# EAGLE schematic seniorDesign (EAGLE 8.7.0)
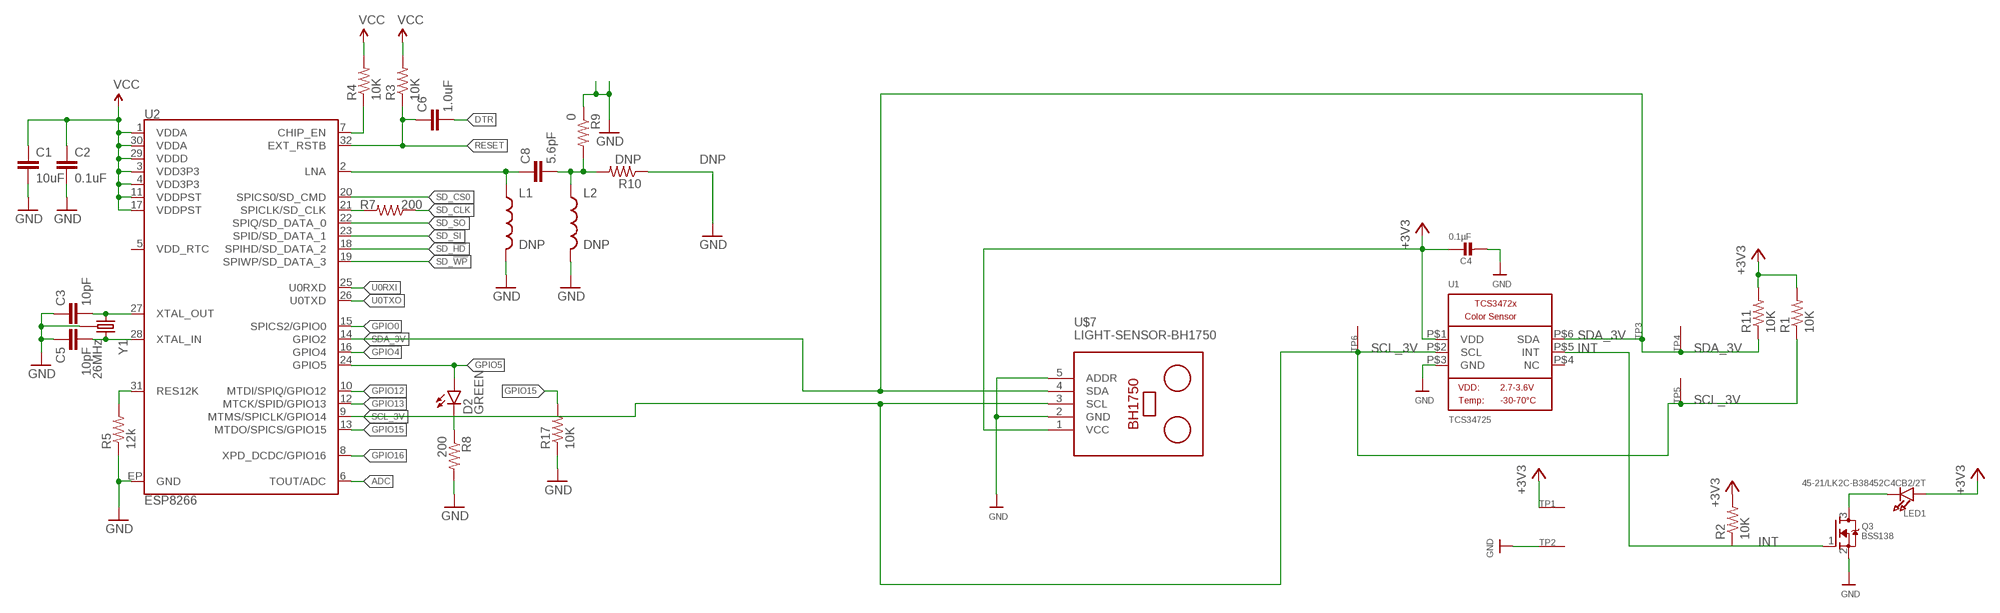
[diagram p0: schematic, sheet 1]

## Parts
C1  10uF  10UF-6.3V-20%(0603)  [0603-CAP]
C2  0.1uF  0.1UF-25V(+80/-20%)(0603)  [0603-CAP]
C3  10pF  10PF-50V-5%(0603)  [0603-CAP]
C4  0.1µF  CAP_CERAMIC_0805  [_0805]
C5  10pF  10PF-50V-5%(0603)  [0603-CAP]
C6  1.0uF  1.0UF-16V-10%(0603)  [0603-CAP]
C8  5.6pF  CAP0603-CAP  [0603-CAP]
D2  GREEN  LED-GREEN0603  [LED-0603]
L1  DNP  INDUCTOR0603  [0603]
L2  DNP  INDUCTOR0603  [0603]
LED1  45-21/LK2C-B38452C4CB2/2T  LEDEV45-21  [EVERLIGHT_45-21]
Q3  BSS138  MOSFET-NWIDE  [SOT23-WIDE]
R1  10K  10KOHM1/10W1%(0603)0603  [0603-RES]
R2  10K  10KOHM1/10W1%(0603)0603  [0603-RES]
R3  10K  10KOHM1/10W1%(0603)0603  [0603-RES]
R4  10K  10KOHM1/10W1%(0603)0603  [0603-RES]
R5  12k  12KOHM-1/10W-1%(0603)  [0603-RES]
R7  200  200OHM1/10W1%(0603)  [0603-RES]
R8  200  200OHM1/10W1%(0603)  [0603-RES]
R9  0  0OHM1/10W5%(0603)  [0603]
R10  DNP  RESISTOR0603-RES  [0603-RES]
R11  10K  10KOHM1/10W1%(0603)0603  [0603-RES]
R17  10K  10KOHM1/10W1%(0603)0603  [0603-RES]
TP1  SEWTAP0.5IN  [SEWINGTAP_0.5]
TP2  SEWTAP0.5IN  [SEWINGTAP_0.5]
TP3  SEWTAP0.5IN  [SEWINGTAP_0.5]
TP4  SEWTAP0.5IN  [SEWINGTAP_0.5]
TP5  SEWTAP0.5IN  [SEWINGTAP_0.5]
TP6  SEWTAP0.5IN  [SEWINGTAP_0.5]
U1  TCS34725  LIGHT_TCS3472  [TCS3472_FN6]
U2  ESP8266  [QFN32]
U$7  LIGHT-SENSOR-BH1750  [LIGHT-SENSOR-BH1750]
Y1  26MHz  CRYSTAL-GROUNDED3.2X2.5  [CRYSTAL-SMD-3.2X2.5]

## Nets
+3V3: C4.1 LED1.A R2.2 R11.2 TP1.TAP(SEW) U1.P$1(VDD) U$7.1(VCC)
ADC: U2.6(TOUT/ADC)
CHIP_EN: R4.1 U2.7(CHIP_EN)
DTR: C6.2
GND: C1.2 C2.2 C3.1 C4.2 C5.1 L1.2 L2.2 Q3.2(S) R5.1 R8.2 R9.1 R10.1 R17.1 TP2.TAP(SEW) U1.P$3(GND) U2.EP(GND) U$7.2(GND) U$7.5(ADDR) Y1.2(GND) Y1.4(GND)
GPIO0: U2.15(SPICS2/GPIO0)
GPIO4: U2.16(GPIO4)
GPIO5: D2.A U2.24(GPIO5)
GPIO12: U2.10(MTDI/SPIQ/GPIO12)
GPIO13: U2.12(MTCK/SPID/GPIO13)
GPIO15: R17.2 U2.13(MTDO/SPICS/GPIO15)
GPIO16: U2.8(XPD_DCDC/GPIO16)
INT: Q3.1(G) U1.P$5(INT)
LNA: C8.1 L1.1 U2.2(LNA)
N$1: LED1.K(C) Q3.3(D)
N$5: R5.2 U2.31(RES12K)
N$6: C5.2 U2.28(XTAL_IN) Y1.3
N$7: C3.2 U2.27(XTAL_OUT) Y1.1
N$8: C8.2 L2.1 R9.2 R10.2
N$9: R7.2 U2.21(SPICLK/SD_CLK)
N$15: D2.C R8.1
RESET: C6.1 R3.1 U2.32(EXT_RSTB)
SCL_3V: TP5.TAP(SEW) TP6.TAP(SEW) U1.P$2(SCL) U2.9(MTMS/SPICLK/GPIO14) U$7.3(SCL)
SD_!HD!: U2.18(SPIHD/SD_DATA_2)
SD_!WP!: U2.19(SPIWP/SD_DATA_3)
SD_CLK: R7.1
SD_CS0: U2.20(SPICS0/SD_CMD)
SD_SI: U2.23(SPID/SD_DATA_1)
SD_SO: U2.22(SPIQ/SD_DATA_0)
SDA_3V: R11.1 TP3.TAP(SEW) TP4.TAP(SEW) U1.P$6(SDA) U2.14(GPIO2) U$7.4(SDA)
U0RXI: U2.25(U0RXD)
U0TXO: U2.26(U0TXD)
VCC: C1.1 C2.1 R3.2 R4.2 U2.1(VDDA) U2.3(VDD3P3) U2.4(VDD3P3) U2.11(VDDPST) U2.17(VDDPST) U2.29(VDDD) U2.30(VDDA)
Unconnected: R1.1 R1.2 R2.1 U1.P$4(NC) U2.5(VDD_RTC)

## Notes on the sheet
- DNP

## Library data of the parts
C1 = SparkFun-Capacitors:10UF-6.3V-20%(0603): CAP-11015; PROD_ID: CAP-11015
C2 = SparkFun-Capacitors:0.1UF-25V(+80/-20%)(0603): CAP-00810 Ceramic Standard decoupling cap; PROD_ID: CAP-00810
C3 C5 = SparkFun-Capacitors:10PF-50V-5%(0603): CAP-11812; PROD_ID: CAP-11812
C4 = microbuilder:CAP_CERAMIC: Ceramic Capacitors For new designs, use the packages preceded by an '_' character since they are more reliable: The following footprints should be used on most boards: _0402 - Standard footprint for regular board layouts _0603 - Standard footprint for regular board layouts _0805 - Standard footprint for regular board layouts For extremely tight-pitch boards where space is at a premium, the following 'micro-pitch' footprints can be used (smaller pads, no silkscreen outline, etc.): _0402MP - Micro-pitch footprint for very dense/compact boards _0603MP - Micro-pitch footprint for very dense/compact boards _0805MP - Micro-pitch footprint for very dense/compact boards Commonly Stocked Parts 0402 - 0402 Surface Mount Capacitors 16pF 50V 5% [Digikey: 445-4899-2-ND] 18pF 50V 5% [Digikey: 490-1281-2-ND] 22pF 50V 5% [Digikey: 490-1283-2-ND] 68pF 50V 5% [Digikey: 490-1289-2-ND] 0.1uF 10V 10% [Digikey: 490-1318-2-ND] 1.0uF 6.3V 10% [Digikey: 490-1320-2-ND] 0603 - 0603 Surface Mount Capacitors 16 pF 50V 5% [Digikey: 445-5051-2-ND] 22 pF 50V [Digikey: PCC220ACVTR-ND] 33 pF 50V 5% [Digikey: 490-1415-1-ND] 56pF 50V 5% [Digikey: 490-1421-1-ND] 220pF 50V 5% [Digikey: 445-1285-1-ND] 680 pF 50V 2200 pF 50V 5% C0G [Digikey: 445-1297-1-ND] 5600 pF 100V 5% X7R [Digikey: 478-3711-1-ND] 0.1 µF 25V 10% [Digikey: PCC2277TR-ND] 0.22 µF 16V 10% X7R [Digikey: 445-1318-1-ND] 1.0 µF 25V 10% [Digikey: 445-5146-2-ND] 0603 - RF Specific 3pF 250V +/-0.1pF RF [Digikey: 712-1347-1-ND] 18 pF 250V 5% [Digikey: 478-3505-1-ND or 712-1322-1-ND] 56 pF 250V 5% C0G RF [Digikey: 490-4867-1-ND] 68 pF 250V RF [Digikey: 490-4868-1-ND] 0805 - 0805 Surface Mount Capacitors 220 pF 250V 2% RF Ceramic Capacitor [Digikey: 712-1398-1-ND] 1000 pF 50V 2% NP0 Ceramic Capacitor [Digikey: 478-3760-1-ND] 0.1 µF 25V 10% Ceramic Capacitor [Digikey: PCC1828TR-ND] 1.0 µF 16V 10% Ceramic Capacitor[Digikey: 490-1691-2-ND] 10.0 µF 10V 10% Ceramic Capacitor[Digikey: 709-1228-1-ND] 10.0 uF 16V 10% Ceramic Capacitor [Digikey: 478-5165-2-ND] 47 uF 6.3V 20% Ceramic Capacitor [Digikey: 587-1779-1-ND or 399-5506-1-ND] 1206 - 1206 Surface Mount Capacitors 47uF 10V 20% Ceramic Capacitor [Digikey: 490-5528-1-ND or 399-5508-1-ND or 445-6010-1-ND] 100uF 6.3V -20%, +80% Y5V Ceramic Capacitor (Digikey: 490-4512-1-ND, Mouser: 81-GRM31CF50J107ZE1L)
C6 = SparkFun-Capacitors:1.0UF-16V-10%(0603): CAP-00868; PROD_ID: CAP-00868
C8 = SparkFun-Capacitors:CAP: Capacitor Standard 0603 ceramic capacitor, and 0.1" leaded capacitor.
D2 = SparkFun-LED:LED-GREEN: Various green LEDs Green LEDs used in SFE Production 0603- DIO-00821 LARGE- DIO-00862 LILYPAD- DIO-09910; PROD_ID: DIO-00821
L1 L2 = SparkFun-Passives:INDUCTOR: Inductors Basic Inductor/Choke - 0603 and 1206. Footprints are not proven and vary greatly between part numbers. SRN6045- 33uH, 20% 1.4A SDR0403-560KL - 56uH, 10%, 500mA RMS/740mA peak
LED1 = microbuilder:LED: LED 0603 - 0603 Surface Mount Package 2mA: Green LED - Low Power (3.9mcd, 2ma, 1.7Vf) - Digikey: 475-2709-2-ND Orange LED - Low Power (9.8mcd, 2ma, 1.8Vf) - Digikey: 475-1194-2-ND Red LED - Low Power (5mcd, 2ma, 1.8Vf) - Digikey: 475-1195-2-ND Yellow LED - Low Power (7mcd, 2ma, 1.8Vf) - Digikey: 475-1196-2-ND 5mA: Blue LED - Low Power (17mcd, 5ma, 2.9Vf) - Digikey: LNJ937W8CRACT-ND 0805 - 0805 Surface Mount Package 2mA: Red LED (8.8mcd, 2mA, 1.8Vf, Clear) - Low Power [Digikey: 475-2510-1-ND] Green LED (5mcd, 2mA, 1.8Vf, Clear) - Low Power [Digikey: 475-2730-1-ND] Yellow LED (11.3mcd, 2mA, 1.8Vf, Clear) - Low Power [Digikey: 475-2555-1-ND] 20mA: Red LED (104mcd, 20mA, Diffused) - LS R976 [Digikey: 475-1278-6-ND] Red LED (12mcd, 20mA, 2.0Vf, Clear) - APT2012EC [Digikey: 754-1128-1-ND] Green LED (15mcd, 20mA, 2.2Vf, Clear) - APT2012GC [Digikey: 754-1131-1-ND] Orange LED (160mcd, 20mA, 2.1Vf, Clear) - APT2012SECK [Digikey: 754-1130-1-ND] 1206 - 1206 Surface Mount Package Green LED (26mcd, 20mA, Diffused) - LG N971 [Digikey: 475-1407-6-ND] Red LED (15mcd, 20mA, Diffused) - LH N974 [Digikey: 475-1416-6-ND] Cree - Cree High-Power Surface Mount LEDs XPEBWT-L1-0000-00D50 - White 111lm 350mA 2.9Vf 6200K 110° XTEAWT-00-0000-00000LEE3 - White 114lm 350mA 2.85Vf 5000K 115° Everlight - Everlight 45-21 Series Surface Mount LEDs 45-21/QK2C-B2832AC2CB2/2T - Warm White 2000mcd 20mA 3.25Vf 3050K 120° 45-21/LK2C-B38452C4CB2/2T - Nuetral White 2000mcd 20mA 3.25Vf 4150K 120° 45-21/LK2C-B50634C6CB2/2T - Cold White 2200mcd 20mA 3.25Vf 5650K 120° PLCC2 Reverse Mount LS T77K-J1L2-1-0-2-R18-Z - Red 11.25mcd 2mA 1.8Vf 630nm 120° LO T77K-L1M2-24-Z - Orange 19.6mcd 2mA 1.8Vf 606nm 120° LY T77K-K2M1-26-Z - Yellow 15.7mcd 2mA 1.8Vf 587nm 120°
Q3 = microbuilder:MOSFET-N: N-Channel Mosfet LEGEND VDS: Voltage Drain-Source ID: Drain Current RDS(ON): Drain-Source On-State Resistance VGS(TH): Gate-Source Threshold Voltage CISS: Drain-Source Input Capacitance SOT-23 Name VDS ID RDS(ON) VGS(TH) CISS Order Number 2N7002E 60V 260mA 2.5 Ohm 2.5V @ 250uA 26.7pF @ 25V 2N7002ET1GOSTR-ND BSH103 30V 850mA 400 mOhm 400mV @ 1mA 83pF @ 24V BSH103,235-ND BSS138 60V 320mA 1.6 Ohm 1.5V @ 250uA 50pF @ 10V Mouser: 771-BSS138PW115 DMN2075U-7 20V 4.2A 38 mOhm 1V @ 250 uA 594.3pF @ 10V DMN2075U-7DICT-ND * BSS138 good choice for I2C level-shifting
R1-R4 R11 R17 = SparkFun-Resistors:10KOHM1/10W1%(0603): RES-00824; PROD_ID: RES-00824
R5 = SparkFun-Resistors:12KOHM-1/10W-1%(0603): RES-10327; PROD_ID: RES-10327
R7 R8 = SparkFun-Resistors:200OHM1/10W1%(0603): RES-08220; PROD_ID: RES-08220
R9 = SparkFun-Resistors:0OHM1/10W5%(0603): RES-08609; PROD_ID: RES-08609
R10 = SparkFun-Passives:RESISTOR: Resistor Basic schematic elements and footprints for 0603, 1206, and PTH resistors.
TP1-TP6 = adafruit:SEWTAP
U1 = microbuilder:LIGHT_TCS3472: TCS3472 RGB + Clear Color Sensor VDD: 2.7-3.6V Temp: -30 - 70°C IR light blocking filter 3,800,000:1 Dynamic Range 2.5µA sleep state Part IDs TCS34725: I2C bus logic = VDD, I2C address: 0x29 TCS34727: I2C bus logic = 1.8V, I2C address: 0x29
U2 = SparkFun-RF:ESP8266: Espressif ESP8266 WiFi Smart Connectivity Platform.; PROD_ID: IC-12452
U$7 = diy-modules:LIGHT-SENSOR-BH1750: Digital Light Sensor based on BH1750 BH1750 datasheet is available here: http://www.mouser.com/ds/2/348/bh1750fvi-e-186247.pdf Arduino Library for BH1750 is available here: https://github.com/claws/BH1750 Video Tutorial is available here: https://www.youtube.com/watch?v=UsLcHSbxf_8 Click here to find device on ebay.com <http://www.ebay.com/sch/bh1750fvi+module> Note: There are many variants. Search for the proper version.
Y1 = things:CRYSTAL-GROUNDED; PROD_ID: XTAL-12454